# EasyEDA Pro project New Project_2025-03-25_15-12-27.eprj, schematic Schematic1_1

## Sheets
1 信号: Board Name: Board1_1; Create Date: 2025-03-25; Page Name: 信号; Project Name: 轮腿; Schematic Name: Schematic1_1; Update Date: 2025-03-25; Company: 嘉立创EDA; Page Size: A4; Version: V1.0
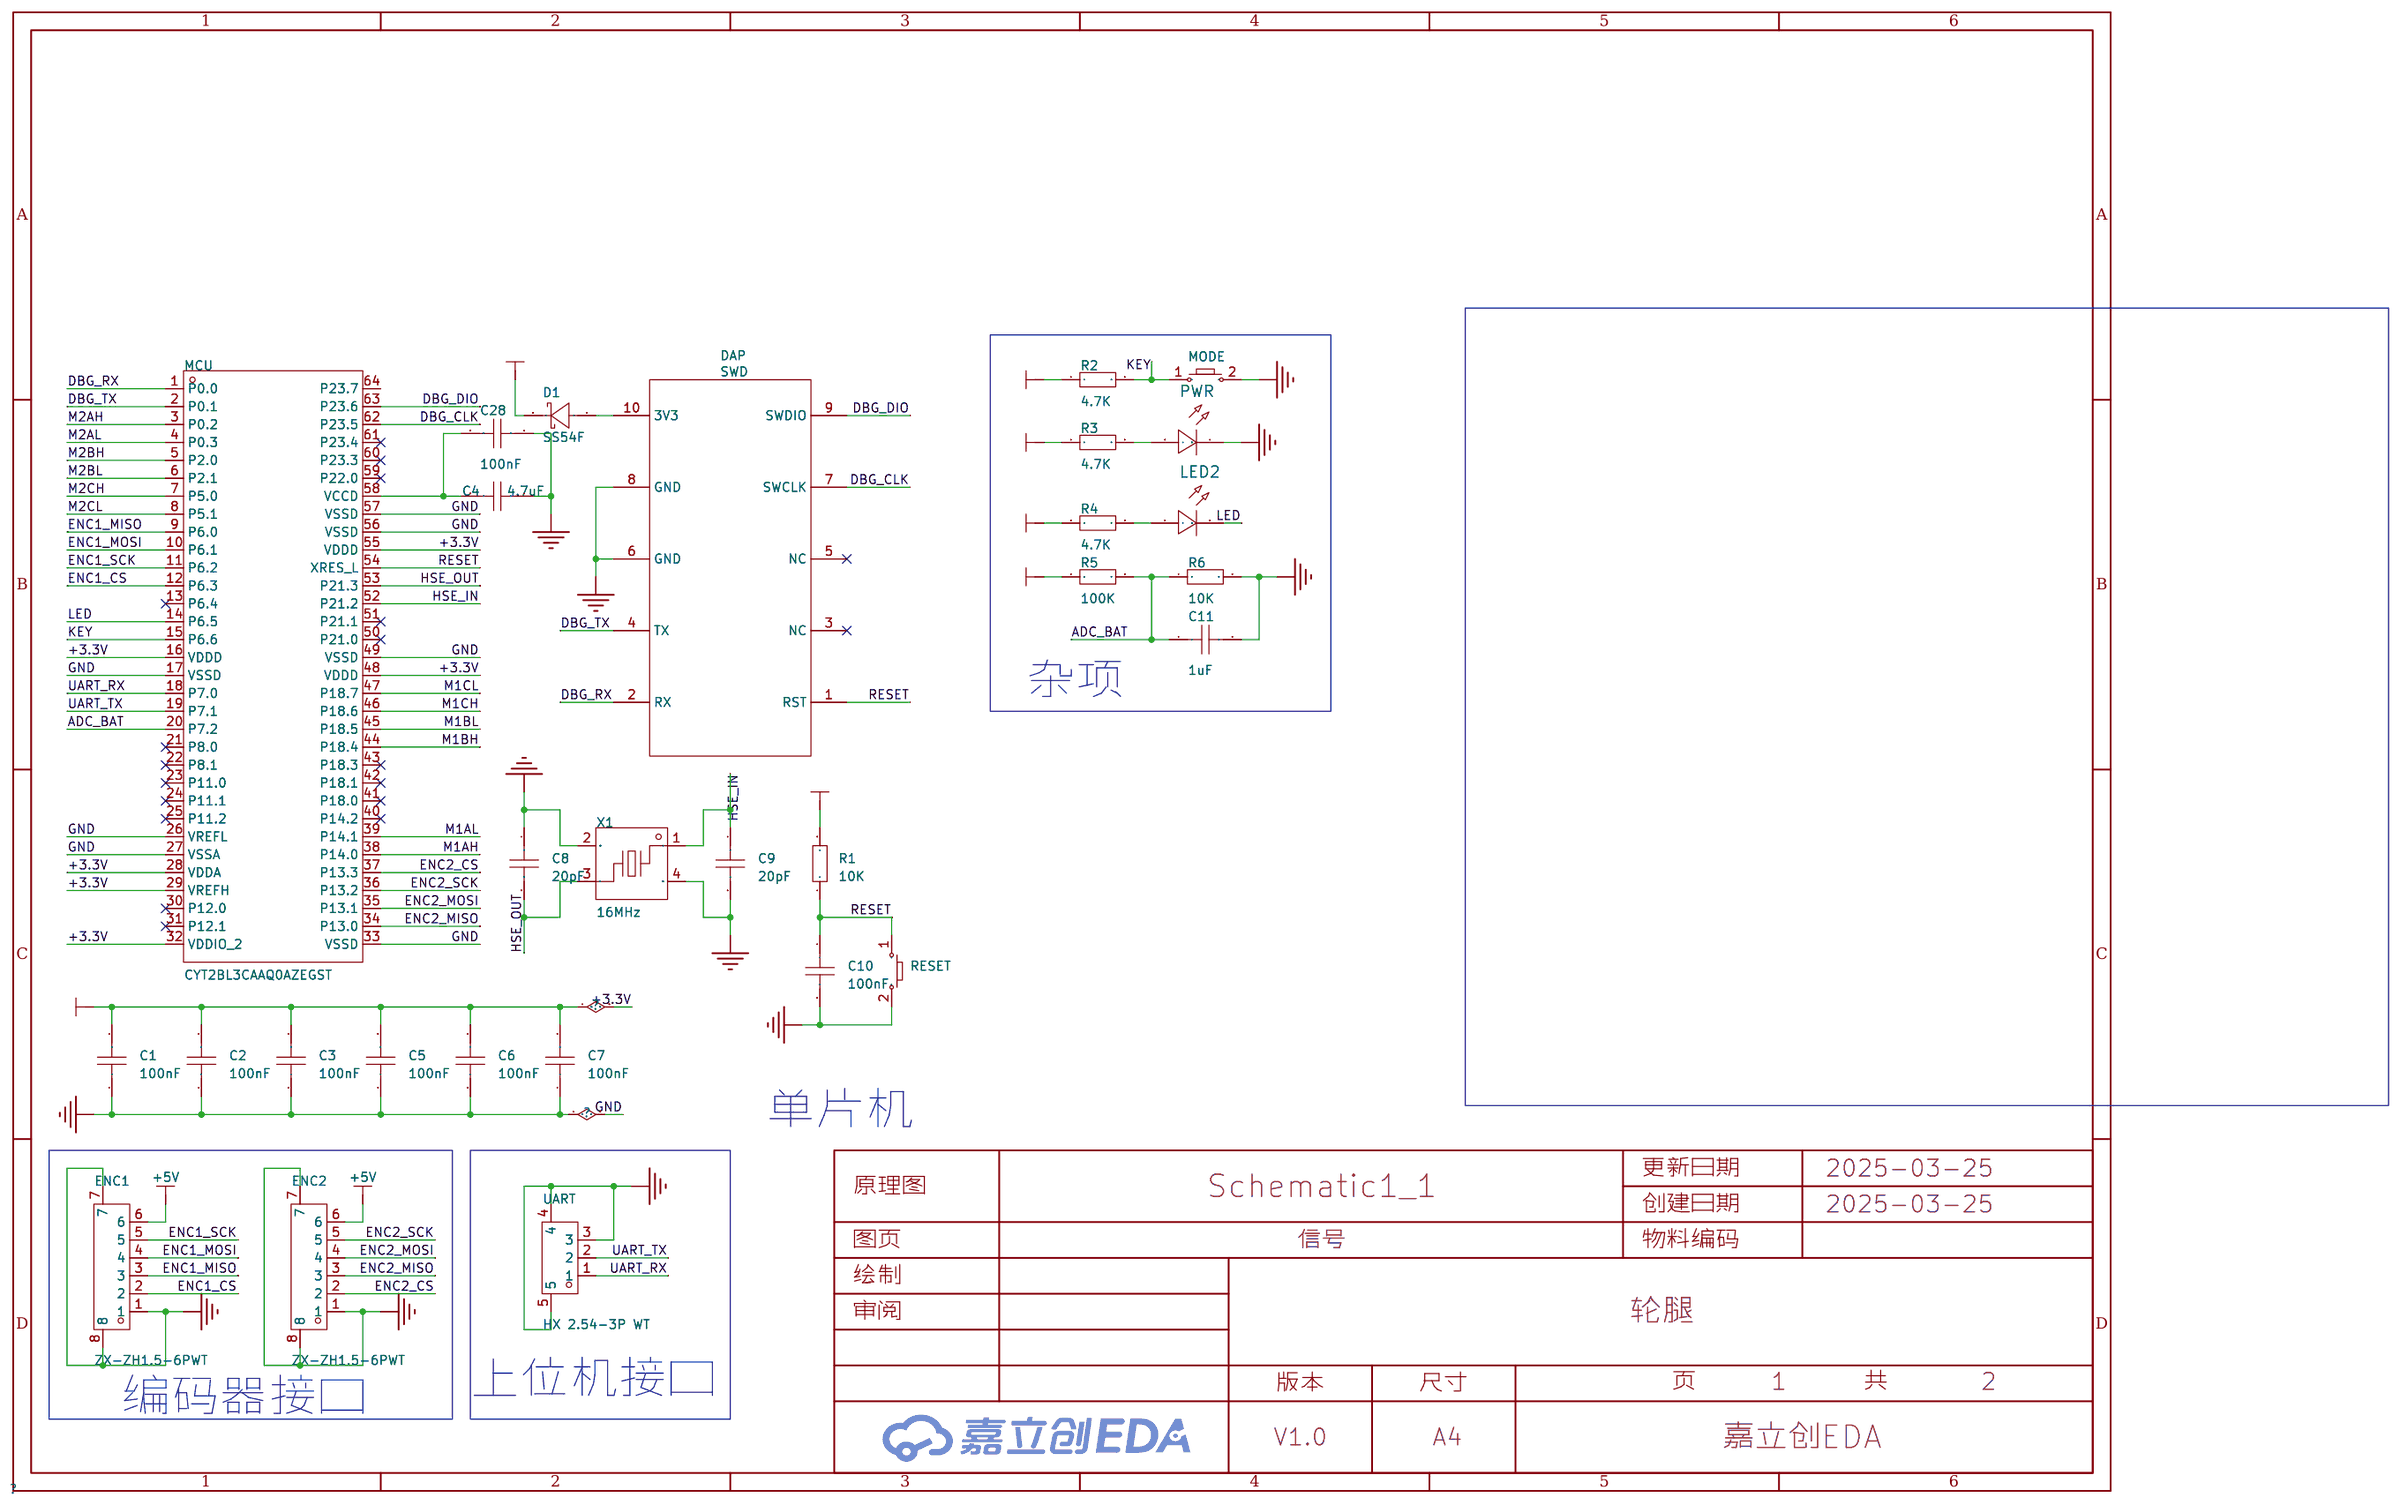
[diagram p2: 信号]
2 功率: Create Date: 2025-03-09; Page Name: 功率; Project Name: 【智能车竞赛】CYT2BL3双路有感FOC驱动（完全兼容逐飞库）; Schematic Name: Schematic1; Update Date: 2025-03-11
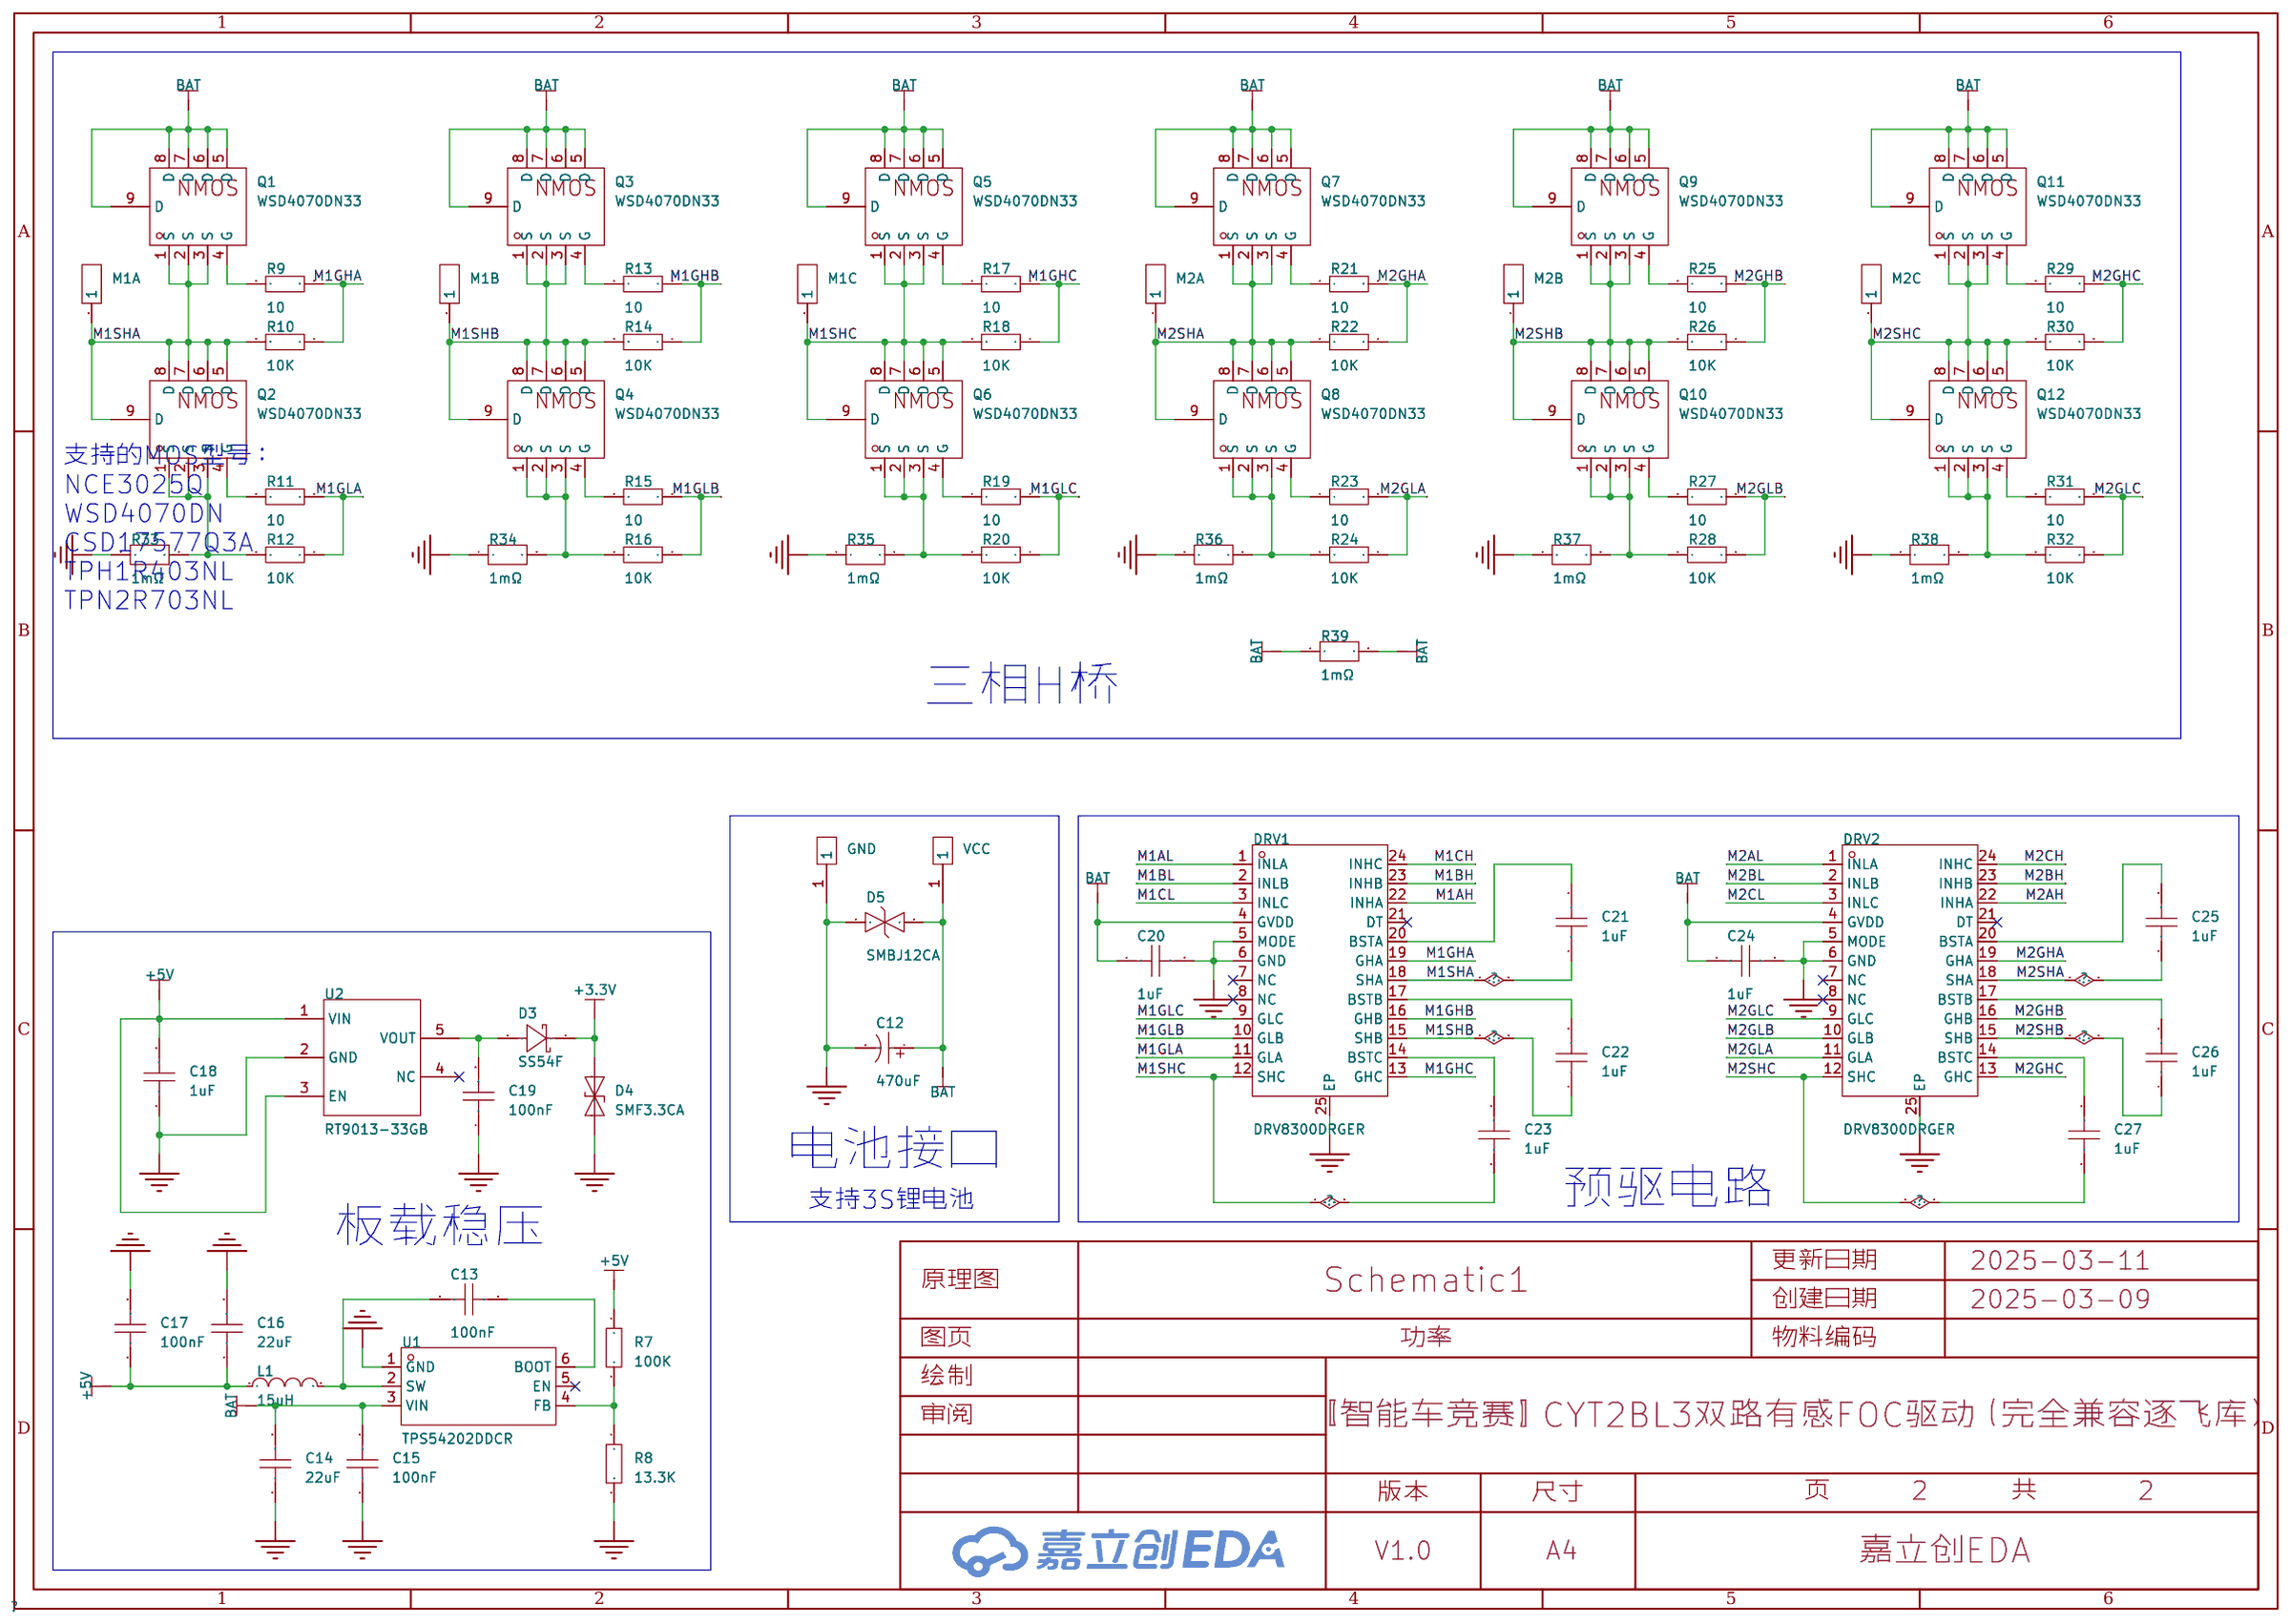
[diagram p3: 功率]

## Parts
sheet 信号
C1  100nF  [C0603]
C2  100nF  [C0603]
C3  100nF  [C0603]
C4  4.7uF  [C0603]
C5  100nF  [C0603]
C6  100nF  [C0603]
C7  100nF  [C0603]
C8  20pF  [C0603]
C9  20pF  [C0603]
C10  100nF  [C0603]
C11  1uF  [C0603]
C28  100nF  [C0603]
D1  SS54F  [SMAF_L3.5-W2.6-LS4.7-RD-1]
DAP  SWD  [2X5 2.54MM双层贴片焊盘]
ENC1  ZX-ZH1.5-6PWT  [CONN-SMD_6P-P1.50_ZX-ZH1.5-6PWT]
ENC2  ZX-ZH1.5-6PWT  [CONN-SMD_6P-P1.50_ZX-ZH1.5-6PWT]
LED2  -  [LED_0603]
MCU  CYT2BL3CAAQ0AZEGST  [LQFP-64_L10.0-W10.0-P0.50-LS12.0-BL]
MODE  -  [Key_SMD_3x4x2]
PWR  -  [LED_0603]
R1  10K  [R0603]
R2  4.7K  [R0603]
R3  4.7K  [R0603]
R4  4.7K  [R0603]
R5  100K  [R0603]
R6  10K  [R0603]
RESET  -  [Key_SMD_3x4x2]
UART  HX 2.54-3P WT  [CONN-SMD_3P-P2.50_HX-2.54-3P-WT]
X1  16MHz  [CRYSTAL-SMD_4P-L2.0-W1.6-BL]
sheet 功率
C12  470uF  [CAP-SMD_BD10.0-L10.3-W10.3-LS11.0-R-RD]
C13  100nF  [C0603]
C14  22uF  [C0805]
C15  100nF  [C0603]
C16  22uF  [C0805]
C17  100nF  [C0603]
C18  1uF  [C0603]
C19  100nF  [C0603]
C20  1uF  [C0603]
C21  1uF  [C0603]
C22  1uF  [C0603]
C23  1uF  [C0603]
C24  1uF  [C0603]
C25  1uF  [C0603]
C26  1uF  [C0603]
C27  1uF  [C0603]
D3  SS54F  [SMAF_L3.5-W2.6-LS4.7-RD-1]
D4  SMF3.3CA  [SOD-123FL_L2.8-W1.8-LS3.7-BI]
D5  SMBJ12CA  [SMB_L4.6-W3.6-LS5.4-BI]
DRV1  DRV8300DRGER  [VQFN-24_L4.0-W4.0-P0.50-TL-EP2.5]
DRV2  DRV8300DRGER  [VQFN-24_L4.0-W4.0-P0.50-TL-EP2.5]
GND  -  [焊盘]
L1  15uH  [IND-SMD_L7.0-W6.6_FXL0630]
M1A  -  [HDR-TH_1P-V-M_XKB_X4611WV-01I-C28D40]
M1B  -  [HDR-TH_1P-V-M_XKB_X4611WV-01I-C28D40]
M1C  -  [HDR-TH_1P-V-M_XKB_X4611WV-01I-C28D40]
M2A  -  [HDR-TH_1P-V-M_XKB_X4611WV-01I-C28D40]
M2B  -  [HDR-TH_1P-V-M_XKB_X4611WV-01I-C28D40]
M2C  -  [HDR-TH_1P-V-M_XKB_X4611WV-01I-C28D40]
Q1  WSD4070DN33  [PDFN3333-8_L3.1-W3.2-P0.65-LS3.4-BL]
Q2  WSD4070DN33  [PDFN3333-8_L3.1-W3.2-P0.65-LS3.4-BL]
Q3  WSD4070DN33  [PDFN3333-8_L3.1-W3.2-P0.65-LS3.4-BL]
Q4  WSD4070DN33  [PDFN3333-8_L3.1-W3.2-P0.65-LS3.4-BL]
Q5  WSD4070DN33  [PDFN3333-8_L3.1-W3.2-P0.65-LS3.4-BL]
Q6  WSD4070DN33  [PDFN3333-8_L3.1-W3.2-P0.65-LS3.4-BL]
Q7  WSD4070DN33  [PDFN3333-8_L3.1-W3.2-P0.65-LS3.4-BL]
Q8  WSD4070DN33  [PDFN3333-8_L3.1-W3.2-P0.65-LS3.4-BL]
Q9  WSD4070DN33  [PDFN3333-8_L3.1-W3.2-P0.65-LS3.4-BL]
Q10  WSD4070DN33  [PDFN3333-8_L3.1-W3.2-P0.65-LS3.4-BL]
Q11  WSD4070DN33  [PDFN3333-8_L3.1-W3.2-P0.65-LS3.4-BL]
Q12  WSD4070DN33  [PDFN3333-8_L3.1-W3.2-P0.65-LS3.4-BL]
R7  100K  [R0603]
R8  13.3K  [R0603]
R9  10  [R0603]
R10  10K  [R0603]
R11  10  [R0603]
R12  10K  [R0603]
R13  10  [R0603]
R14  10K  [R0603]
R15  10  [R0603]
R16  10K  [R0603]
R17  10  [R0603]
R18  10K  [R0603]
R19  10  [R0603]
R20  10K  [R0603]
R21  10  [R0603]
R22  10K  [R0603]
R23  10  [R0603]
R24  10K  [R0603]
R25  10  [R0603]
R26  10K  [R0603]
R27  10  [R0603]
R28  10K  [R0603]
R29  10  [R0603]
R30  10K  [R0603]
R31  10  [R0603]
R32  10K  [R0603]
R33  1mΩ  [R2512]
R34  1mΩ  [R2512]
R35  1mΩ  [R2512]
R36  1mΩ  [R2512]
R37  1mΩ  [R2512]
R38  1mΩ  [R2512]
R39  1mΩ  [R2512]
U1  TPS54202DDCR  [SOT-23-6_L2.9-W1.6-P0.95-LS2.8-BL]
U2  RT9013-33GB  [SOT-23-5_L3.0-W1.7-P0.95-LS2.8-BL]
VCC  -  [焊盘]

## Library data of the parts
C1-C11 C13 C15 C17-C28 = CAP_0603: Supplier Footprint: 0603
D1 D3 = SS54F_C18199179: 二极管配置:独立式;正向压降(Vf):550mV@5.0A;直流反向耐压(Vr):40V;整流电流:5A;; LCSC Part Name: 电压:40V 电流:5A; Supplier Part: C18199179; Manufacturer: 宏嘉诚; Supplier Footprint: SMAF; Datasheet: https://atta.szlcsc.com/upload/public/pdf/source/20250121/FDB92513849E10B53DCF948A58635644.pdf; Supplier: LCSC; Diode Configuration: 独立式; Voltage - Forward(Vf@If): 550mV@5.0A; Voltage - DC Reverse(Vr): 40V; Current - Rectified: 5A; Reverse Leakage Current (Ir): 200uA@40V
DAP = SWD
ENC1 ENC2 = ZX-ZH1.5-6PWT: 插针结构:1x6P;间距:1.5mm;安装方式:卧贴;参考系列:ZH;总PIN数:6P;排数:1;每排PIN数:6;行距:-;额定电流:1A;触头材质:黄铜;触头镀层:锡;工作温度范围:-25℃~+85℃;; LCSC Part Name: 1x6P 间距:1.5mm 卧贴 系列:ZH; Supplier Part: C19272409; Manufacturer: Megastar(兆星); Supplier Footprint: SMD,P=1.5mm,卧贴; Datasheet: https://atta.szlcsc.com/upload/public/pdf/source/20231201/C5A824B953C40A6060EBF5A541254C86.pdf; Supplier: LCSC; Pins Structure: 1x6P; Pitch: 1.5mm; Mounting Type: 卧贴; Reference Series: ZH; Number of Pins: 6P; Number of Rows: 1; Number of PINs Per Row: 6; Rated Current: 1A; Contact Material: 黄铜; Contact Plating: 锡; Operating Temperature: -25℃~+85℃; Rated Voltage (Max): 250V; Plastic Material: LCP; Supplementary Features: 辅助焊脚; Color: 米色; Z-Height of the Board: 3.8mm; X-Length of Bottom Edge on Board (Spacing Line): 12mm; Y-Width of Bottom Edge on Board: 6.5mm
LED2 PWR = LED_0603-R: Supplier Footprint: 0603
MCU = CYT2BL3CAAQ0AZEGST: CPU内核:ARM-M4；ARM-M0+;CPU最大主频:100MHz；160MHz;应用领域:-;; Supplier Part: C6814187; Manufacturer: Infineon(英飞凌); Supplier Footprint: LQFP-64(10x10); Datasheet: https://atta.szlcsc.com/upload/public/pdf/source/20241028/9C5F45A22757023D6821BF2A2597B3D9.pdf; Supplier: LCSC; CPU Core: ARM-M4；ARM-M0+; CPU Maximum Speed: 100MHz；160MHz; Number of I/O: 49; ADC (Bit): 12bit; Low Voltage Detection Threshold: 2.7V~5.5V
MODE RESET = Key_SMD_3x4x2: Supplier Footprint: SMD
R1-R32 = Res_0603: Supplier Footprint: 0603
UART = HX 2.54-3P WT: 插针结构:1x3P;间距:2.54mm;安装方式:卧贴;总PIN数:3P;排数:1;每排PIN数:3;额定电流:3A;工作温度范围:-25℃~+85℃;; LCSC Part Name: 1x3P 间距:2.54mm 卧贴; Supplier Part: C5142099; Manufacturer: hanxia(韩下); Supplier Footprint: SMD,P=2.5mm; Datasheet: https://atta.szlcsc.com/upload/public/pdf/source/20220818/9F420A94DD0AA336B6D93866F6C8C14E.pdf; Supplier: LCSC; Pins Structure: 1x3P; Pitch: 2.54mm; Mounting Style: 卧贴; Number of Pins: 3P; Number of Rows: 1; Number of PINs Per Row: 3; Current Rating (Max): 3A; Operating Temperature Range: -25℃~+85℃
X1 = XL7EL89COI-111YLC-16M: 晶振类型:贴片晶振;频率:16MHz;常温频差:±10ppm;外接负载电容:12pF;频率稳定度(全温):±20ppm;; LCSC Part Name: 16MHz ±10ppm 12pF; Supplier Part: C2965579; Manufacturer: YXC(扬兴晶振); Supplier Footprint: SMD2016-4P; Datasheet: https://atta.szlcsc.com/upload/public/pdf/source/20240329/C26C9A15A73CBCFBF373B30A8E126750.pdf; Supplier: LCSC; Crystal Type: 贴片晶振; Normal temperature Frequency Tolerance: ±10ppm; External load capacitor: 12pF; Frequency Stability(Full temperature range): ±20ppm; Operating Temperature: -40℃~+85℃
C12 = RVT1V471M1010_C72519: 容值:470uF;精度:±20%;额定电压:35V;纹波电流:286mA@120Hz;等效串联电阻(ESR):-;; LCSC Part Name: 470uF ±20% 35V; Supplier Part: C72519; Manufacturer: ROQANG(容强); Manufacturer Part: RVT1V471M1010; Supplier Footprint: SMD,D10xL10.2mm; Datasheet: https://atta.szlcsc.com/upload/public/pdf/source/20210128/C72519_A1B8ED607B11AD36B70B1D23AFC8819E.pdf; Supplier: LCSC; Tolerance: ±20%; Voltage Rating: 35V; Ripple Current: 286mA@120Hz; Diameter: 10mm; Height - Seated (Max): 10.2mm; Lifetime: 2000hrs@105℃; Operating Temperature: -40℃~+105℃
C14 C16 = CAP_0805: Supplier Footprint: 0805
D4 = SMF3.3CA_C22449587: Supplier Part: C22449587; Manufacturer: FUXINSEMI(富芯森美); Supplier Footprint: SOD-123FL; Datasheet: https://atta.szlcsc.com/upload/public/pdf/source/20240605/C488926F711132323E412A32CBCBD16A.pdf; Supplier: LCSC
D5 = SMBJ12CA_C19077566: 极性:双向;反向截止电压(Vrwm):12V;钳位电压:19.9V;峰值脉冲电流(Ipp):30.15A;峰值脉冲功率(Ppp):600W;击穿电压:13.3V;; Supplier Part: C19077566; Manufacturer: 宏嘉诚; Supplier Footprint: SMB; Datasheet: https://atta.szlcsc.com/upload/public/pdf/source/20250107/474F05451FC8AB27D7FA0238914F96F6.pdf; Supplier: LCSC; Polarity: 双向; Reverse Stand-Off Voltage (Vrwm): 12V; Clamping Voltage: 19.9V; Peak Pulse Current (Ipp): 30.15A; Peak Pulse Power Dissipation (Ppp): 600W; Voltage - Breakdown: 13.3V; Reverse Leakage Current (Ir): 5uA; Number of Channels: 单路; Type: TVS
DRV1 DRV2 = DRV8300DRGER_C3655801: 驱动配置:低边；高边;负载类型:MOSFET;驱动通道数:3;峰值灌电流:1.5A;峰值拉电流:750mA;电源电压:5V~20V;上升时间:12ns;下降时间:12ns;; Supplier Part: C3655801; Manufacturer: TI(德州仪器); Supplier Footprint: VQFN-24(4x4); Datasheet: https://www.ti.com/cn/lit/gpn/drv8300; Supplier: LCSC; Driven Configuration: 低边；高边; Load Type: MOSFET; Number of Drivers: 3; Peak Output Current(sink): 1.5A; Peak Output Current(source): 750mA; Supply Voltage: 5V~20V; Rise Time: 12ns; Fall Time: 12ns; Operating Temperature: -40℃~+125℃@(Ta)
GND VCC = 焊盘: Pin Type: IN; _: 3
L1 = FXL0630-150-M: 电感值:15uH;精度:±20%;额定电流:3A;饱和电流(Isat):4.5A;类型:一体成型电感;; LCSC Part Name: 15uH ±20% 4.5A; Supplier Part: C177243; Manufacturer: cjiang(长江微电); Supplier Footprint: SMD,6.6x7mm; Datasheet: https://atta.szlcsc.com/upload/public/pdf/source/20240426/3189EA8206330E2108542F9E34E540E7.pdf; Supplier: LCSC; Tolerance: ±20%; Rated Current: 3A; Saturation Current (Isat): 4.5A; DC Resistance (DCR): 115mΩ; Type: 一体成型电感
M1A M1B M1C M2A M2B M2C = HDR-M_2.54_1x1P: Supplier Part: C81276; Supplier Footprint: 插件; JLCPCB Part Class: Extended Part
Q1-Q12 = WSD4070DN33: 类型:1个N沟道;漏源电压(Vdss):40V;连续漏极电流(Id):68A;导通电阻(RDS(on)@Vgs,Id):4.5mΩ@10V,7A;功率:3.1W;阈值电压(Vgs(th)@Id):1.9V@250uA;; LCSC Part Name: 1个N沟道 耐压:40V 电流:68A; Supplier Part: C719095; Manufacturer: WINSOK(微硕); Supplier Footprint: PDFN3333-8; Datasheet: https://atta.szlcsc.com/upload/public/pdf/source/20240611/C3187B854891BFB7BDFB624E9267BA1F.pdf; Supplier: LCSC; Type: 1个N沟道; Drain Source Voltage (Vdss): 40V; Continuous Drain Current (Id): 68A; Drain Source On Resistance (RDS(on)@Vgs,Id): 4.5mΩ@10V,7A; Power Dissipation (Pd): 3.1W; Gate Threshold Voltage (Vgs(th)@Id): 1.9V@250uA; Total Gate Charge (Qg@Vgs): 28nC@10V; Input Capacitance (Ciss@Vds): 2.42nF@20V; Reverse Transfer Capacitance (Crss@Vds): 150pF@20V; Operating Temperature: -55℃~+150℃@(Tj)
R33-R39 = FRP2512F0000TS: 电阻类型:厚膜电阻;阻值:0Ω;精度:±1%;功率:2W;最大工作电压:200V;温度系数:±200ppm/℃;; LCSC Part Name: 0Ω ±1% 2W 厚膜电阻; Supplier Part: C5204052; Manufacturer: FOJAN(富捷); Supplier Footprint: 2512; Datasheet: https://atta.szlcsc.com/upload/public/pdf/source/20211221/925EC7D7225764EE0046F22065062C87.pdf; Supplier: LCSC; Type: 厚膜电阻; Tolerance: ±1%; Power(Watts): 2W; Overload Voltage (Max): 200V; Temperature Coefficient: ±200ppm/℃
U1 = TPS54202DDCR: 功能类型:降压型;输出类型:可调;工作电压:4.5V~28V;输出电压:-;输出电流:2A;; LCSC Part Name: 4.5V至28V输入、2A输出、低EMI同步降压转换器; Supplier Part: C191884; Manufacturer: TI(德州仪器); Supplier Footprint: SOT-23-6; Datasheet: https://www.ti.com/cn/lit/gpn/tps54202; Supplier: LCSC; Function: 降压型; Output Type: 可调; Input Voltage: 4.5V~28V; Output Current: 2A; Switching Frequency: 500kHz; Operating Temperature: -40℃~+125℃; Synchronous Rectification: 是; Number of Outputs: 1; Topology: 降压式; Quiescent Current (Iq): 45uA; Switch tube (built-in/external): 内置
U2 = RT9013-33GB: 输出类型:固定;最大输入电压:5.5V;输出电压:3.3V;输出电流:500mA;电源纹波抑制比(PSRR):50dB@(10kHz);输出极性:正极;; LCSC Part Name: 输入5.5V 输出3.3V 500mA; Supplier Part: C47773; Manufacturer: RICHTEK(立锜); Supplier Footprint: SOT-23-5; Datasheet: https://atta.szlcsc.com/upload/public/pdf/source/20150504/1457707282459.pdf; Supplier: LCSC; Output Type: 固定; Maximum Input Voltage: 5.5V; Output Voltage: 3.3V; Output Current: 500mA; Power Supply Rejection Ratio (PSRR): 50dB@(10kHz); Dropout Voltage: 400mV@(500mA); standby current: 50uA; Feature: 低ESR；防静电保护；热保护(TSD)；过流保护(OCP)；带使能; Operating Temperature: -40℃~+85℃; Output Polarity: 正极; Number of Outputs: 1

## Nets
+3.3V: C1.2 C2.2 C3.2 C5.2 C6.2 C7.2 D1.1(K) D3.1(K) D4.2 MCU.16(VDDD) MCU.28(VDDA) MCU.29(VREFH) MCU.32(VDDIO_2) MCU.48(VDDD) MCU.55(VDDD) R1.2 R2.1 R3.1 R4.1
+5V: C16.1 C17.1 C18.2 ENC1.6 ENC2.6 L1.1 R7.1 U2.1(VIN) U2.3(EN)
GND: C1.1 C2.1 C3.1 C4.1 C5.1 C6.1 C7.1 C8.1 C9.2 C10.2 C11.2 C12.2 C14.1 C15.1 C16.2 C17.2 C18.1 C19.1 C20.2 C24.2 C28.1 D4.1 D5.1 DAP.6(GND) DAP.8(GND) DRV1.5(MODE) DRV1.6(GND) DRV1.25(EP) DRV2.5(MODE) DRV2.6(GND) DRV2.25(EP) ENC1.1 ENC1.7 ENC1.8 ENC2.1 ENC2.7 ENC2.8 GND.1 MCU.17(VSSD) MCU.26(VREFL) MCU.27(VSSA) MCU.33(VSSD) MCU.49(VSSD) MCU.56(VSSD) MCU.57(VSSD) MODE.2 PWR.1(C) R6.2 R8.2 R33.1 R34.1 R35.1 R36.1 R37.1 R38.1 RESET.2 U1.1(GND) U2.2(GND) UART.3 UART.4 UART.5 X1.2(GND) X1.4(GND)
ADC_BAT: C11.1 MCU.20(P7.2) R5.2 R6.1
BAT: C12.1 C14.2 C15.2 C20.1 C24.1 D5.2 DRV1.4(GVDD) DRV2.4(GVDD) Q1.5(D) Q1.6(D) Q1.7(D) Q1.8(D) Q1.9(D) Q3.5(D) Q3.6(D) Q3.7(D) Q3.8(D) Q3.9(D) Q5.5(D) Q5.6(D) Q5.7(D) Q5.8(D) Q5.9(D) Q7.5(D) Q7.6(D) Q7.7(D) Q7.8(D) Q7.9(D) Q9.5(D) Q9.6(D) Q9.7(D) Q9.8(D) Q9.9(D) Q11.5(D) Q11.6(D) Q11.7(D) Q11.8(D) Q11.9(D) R5.1 R39.1 R39.2 U1.3(VIN) VCC.1
DBG_CLK: DAP.7(SWCLK) MCU.62(P23.5)
DBG_DIO: DAP.9(SWDIO) MCU.63(P23.6)
DBG_RX: DAP.2(RX) MCU.1(P0.0)
DBG_TX: DAP.4(TX) MCU.2(P0.1)
ENC1_CS: ENC1.2 MCU.12(P6.3)
ENC1_MISO: ENC1.3 MCU.9(P6.0)
ENC1_MOSI: ENC1.4 MCU.10(P6.1)
ENC1_SCK: ENC1.5 MCU.11(P6.2)
ENC2_CS: ENC2.2 MCU.37(P13.3)
ENC2_MISO: ENC2.3 MCU.34(P13.0)
ENC2_MOSI: ENC2.4 MCU.35(P13.1)
ENC2_SCK: ENC2.5 MCU.36(P13.2)
HSE_IN: C9.1 MCU.52(P21.2) X1.1
HSE_OUT: C8.2 MCU.53(P21.3) X1.3
KEY: MCU.15(P6.6) MODE.1 R2.2
LED: LED2.1(C) MCU.14(P6.5)
M1AH: DRV1.22(INHA) MCU.38(P14.0)
M1AL: DRV1.1(INLA) MCU.39(P14.1)
M1BH: DRV1.23(INHB) MCU.44(P18.4)
M1BL: DRV1.2(INLB) MCU.45(P18.5)
M1CH: DRV1.24(INHC) MCU.46(P18.6)
M1CL: DRV1.3(INLC) MCU.47(P18.7)
M1GHA: DRV1.19(GHA) R9.2 R10.1
M1GHB: DRV1.16(GHB) R13.2 R14.1
M1GHC: DRV1.13(GHC) R17.2 R18.1
M1GLA: DRV1.11(GLA) R11.2 R12.1
M1GLB: DRV1.10(GLB) R15.2 R16.1
M1GLC: DRV1.9(GLC) R19.2 R20.1
M1SHA: C21.1 DRV1.18(SHA) M1A.1 Q1.1(S) Q1.2(S) Q1.3(S) Q2.5(D) Q2.6(D) Q2.7(D) Q2.8(D) Q2.9(D) R10.2
M1SHB: C22.1 DRV1.15(SHB) M1B.1 Q3.1(S) Q3.2(S) Q3.3(S) Q4.5(D) Q4.6(D) Q4.7(D) Q4.8(D) Q4.9(D) R14.2
M1SHC: C23.1 DRV1.12(SHC) M1C.1 Q5.1(S) Q5.2(S) Q5.3(S) Q6.5(D) Q6.6(D) Q6.7(D) Q6.8(D) Q6.9(D) R18.2
M2AH: DRV2.22(INHA) MCU.3(P0.2)
M2AL: DRV2.1(INLA) MCU.4(P0.3)
M2BH: DRV2.23(INHB) MCU.5(P2.0)
M2BL: DRV2.2(INLB) MCU.6(P2.1)
M2CH: DRV2.24(INHC) MCU.7(P5.0)
M2CL: DRV2.3(INLC) MCU.8(P5.1)
M2GHA: DRV2.19(GHA) R21.2 R22.1
M2GHB: DRV2.16(GHB) R25.2 R26.1
M2GHC: DRV2.13(GHC) R29.2 R30.1
M2GLA: DRV2.11(GLA) R23.2 R24.1
M2GLB: DRV2.10(GLB) R27.2 R28.1
M2GLC: DRV2.9(GLC) R31.2 R32.1
M2SHA: C25.1 DRV2.18(SHA) M2A.1 Q7.1(S) Q7.2(S) Q7.3(S) Q8.5(D) Q8.6(D) Q8.7(D) Q8.8(D) Q8.9(D) R22.2
M2SHB: C26.1 DRV2.15(SHB) M2B.1 Q9.1(S) Q9.2(S) Q9.3(S) Q10.5(D) Q10.6(D) Q10.7(D) Q10.8(D) Q10.9(D) R26.2
M2SHC: C27.1 DRV2.12(SHC) M2C.1 Q11.1(S) Q11.2(S) Q11.3(S) Q12.5(D) Q12.6(D) Q12.7(D) Q12.8(D) Q12.9(D) R30.2
RESET: C10.1 DAP.1(RST) MCU.54(XRES_L) R1.1 RESET.1
UART_RX: MCU.18(P7.0) UART.1
UART_TX: MCU.19(P7.1) UART.2
$1N1857: D1.2(A) DAP.10(3V3)
$1N2887: PWR.2(A) R3.2
$1N2902: LED2.2(A) R4.2
$1N5314: C4.2 C28.2 MCU.58(VCCD)
$2N565: C13.1 L1.2 U1.2(SW)
$2N574: C13.2 U1.6(BOOT)
$2N1032: R7.2 R8.1 U1.4(FB)
$2N1462: C19.2 D3.2(A) U2.5(VOUT)
$2N2541: Q1.4(G) R9.1
$2N2559: Q2.4(G) R11.1
$2N3129: Q3.4(G) R13.1
$2N3132: Q4.4(G) R15.1
$2N3427: Q5.4(G) R17.1
$2N3430: Q6.4(G) R19.1
$2N4215: Q7.4(G) R21.1
$2N4218: Q8.4(G) R23.1
$2N4270: Q9.4(G) R25.1
$2N4273: Q10.4(G) R27.1
$2N4325: Q11.4(G) R29.1
$2N4328: Q12.4(G) R31.1
$2N5197: C21.2 DRV1.20(BSTA)
$2N5203: C22.2 DRV1.17(BSTB)
$2N5219: C23.2 DRV1.14(BSTC)
$2N5621: C25.2 DRV2.20(BSTA)
$2N5626: C26.2 DRV2.17(BSTB)
$2N5629: C27.2 DRV2.14(BSTC)
$2N6397: Q2.1(S) Q2.2(S) Q2.3(S) R12.2 R33.2
$2N6459: Q4.1(S) Q4.2(S) Q4.3(S) R16.2 R34.2
$2N6493: Q6.1(S) Q6.2(S) Q6.3(S) R20.2 R35.2
$2N6527: Q8.1(S) Q8.2(S) Q8.3(S) R24.2 R36.2
$2N6561: Q10.1(S) Q10.2(S) Q10.3(S) R28.2 R37.2
$2N6595: Q12.1(S) Q12.2(S) Q12.3(S) R32.2 R38.2

Not connected (* = marked no-connect by the designer): DAP 3(NC)* 5(NC)*; DRV1 7(NC)* 8(NC)* 21(DT)*; DRV2 7(NC)* 8(NC)* 21(DT)*; MCU 13(P6.4)* 21(P8.0)* 22(P8.1)* 23(P11.0)* 24(P11.1)* 25(P11.2)* 30(P12.0)* 31(P12.1)* 40(P14.2)* 41(P18.0)* 42(P18.1)* 43(P18.3)* 50(P21.0)* 51(P21.1)* 59(P22.0)* 60(P23.3)* 61(P23.4)* 64(P23.7); U1 5(EN)*; U2 4(NC)*

## Notes on the sheets
sheet 1
- 杂项
- 单片机
- 编码器接口
- 上位机接口
sheet 2
- 支持的MOS型号：
  NCE3025Q
  WSD4070DN
  CSD17577Q3A
  TPH1R403NL
  TPN2R703NL
- 三相H桥
- 电池接口
- 支持3S锂电池
- 预驱电路
- 板载稳压
